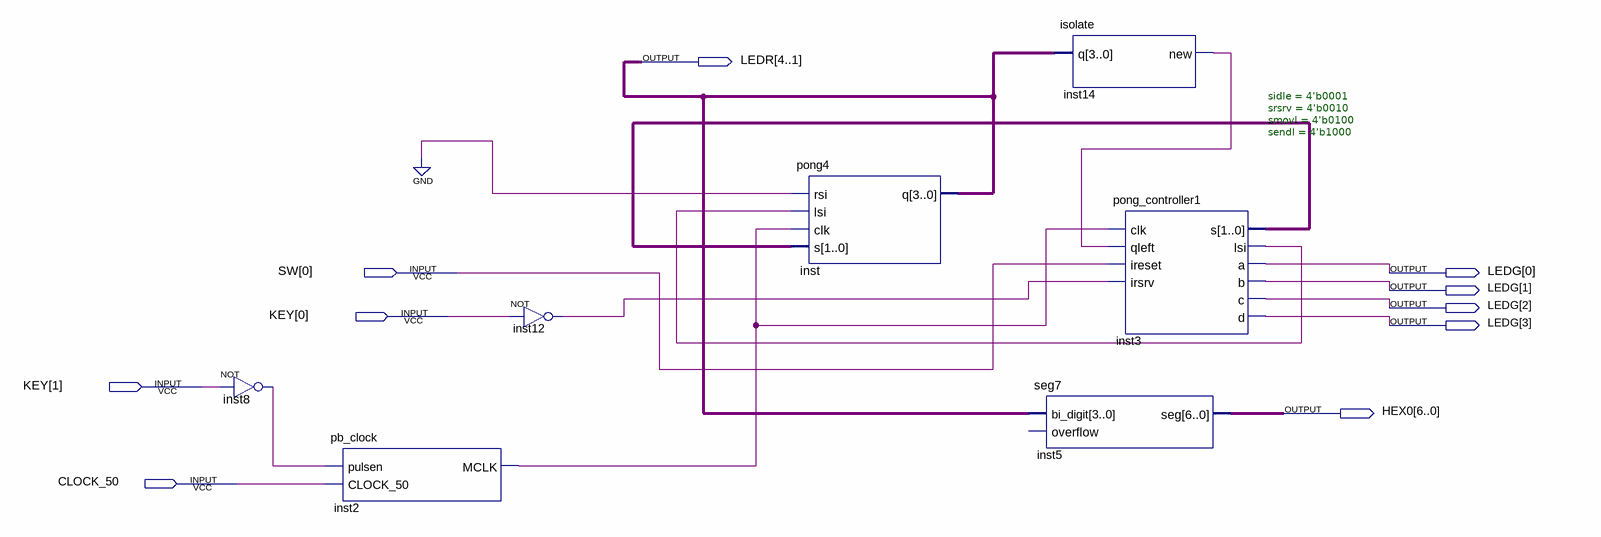
[diagram p0: schematic sheet]
// Quartus schematic lab8.bdf as structural Verilog: 7 symbols, 10 pins
module lab8 (
  input  [0:0] SW,
  input  [1:0] KEY,
  input  CLOCK_50,
  output [4:1] LEDR,
  output [3:0] LEDG,
  output [6:0] HEX0
);

  wire inst2_mclk, inst3_lsi, inst8_out, inst12_out, inst14_new;
  wire [1:0] inst3_s;

  not inst8 (inst8_out, KEY[1]);
  pb_clock inst2 (.pulsen(inst8_out), .CLOCK_50(CLOCK_50), .MCLK(inst2_mclk));
  not inst12 (inst12_out, KEY[0]);
  pong4 inst (.rsi(1'b0), .lsi(inst3_lsi), .clk(inst2_mclk), .s(inst3_s), .q(LEDR));
  seg7 inst5 (.bi_digit(LEDR), .seg(HEX0));  // open: overflow
  isolate inst14 (.q(LEDR), .\new (inst14_new));
  pong_controller1 #(.sidle(4'b0001), .srsrv(4'b0010), .smovl(4'b0100), .sendl(4'b1000)) inst3 (
    .clk(inst2_mclk), .qleft(inst14_new), .ireset(SW[0]), .irsrv(inst12_out), .s(inst3_s), .lsi(inst3_lsi),
    .a(LEDG[0]), .b(LEDG[1]), .c(LEDG[2]), .d(LEDG[3]));
endmodule
